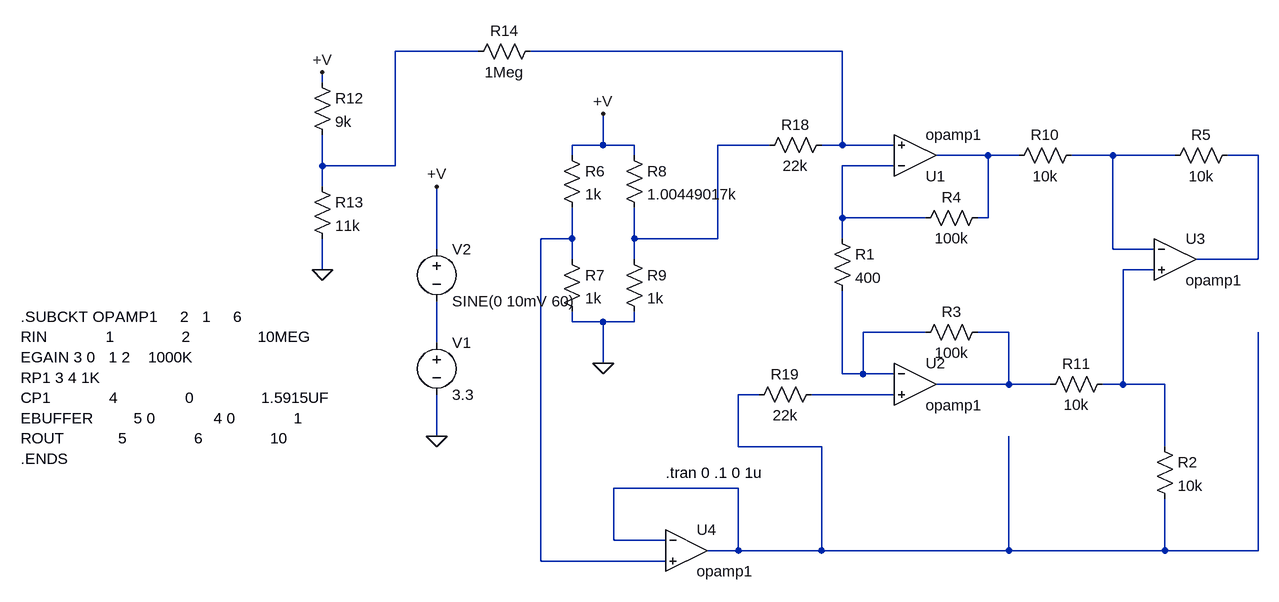
[diagram p0: schematic amp01.asc]
amp01.asc, the LTspice schematic file:
Version 4
SHEET 1 1124 732
WIRE -352 -272 -480 -272
WIRE 208 -272 -272 -272
WIRE -592 -224 -592 -240
WIRE -160 -128 -160 -176
WIRE -160 -128 -208 -128
WIRE -112 -128 -160 -128
WIRE 96 -128 16 -128
WIRE 208 -128 208 -272
WIRE 208 -128 176 -128
WIRE 288 -128 208 -128
WIRE -208 -112 -208 -128
WIRE -112 -112 -112 -128
WIRE 432 -112 352 -112
WIRE 480 -112 432 -112
WIRE 624 -112 560 -112
WIRE 720 -112 624 -112
WIRE 848 -112 800 -112
WIRE -592 -96 -592 -144
WIRE -480 -96 -480 -272
WIRE -480 -96 -592 -96
WIRE 288 -96 208 -96
WIRE -592 -64 -592 -96
WIRE 208 -16 208 -96
WIRE 336 -16 208 -16
WIRE 432 -16 432 -112
WIRE 432 -16 416 -16
WIRE -208 16 -208 -32
WIRE -208 16 -256 16
WIRE -112 16 -112 -32
WIRE 16 16 16 -128
WIRE 16 16 -112 16
WIRE 208 16 208 -16
WIRE -416 32 -416 -64
WIRE 624 32 624 -112
WIRE 688 32 624 32
WIRE -208 48 -208 16
WIRE -112 48 -112 16
WIRE 848 48 848 -112
WIRE 848 48 752 48
WIRE -592 64 -592 16
WIRE 688 64 640 64
WIRE -208 144 -208 128
WIRE -160 144 -208 144
WIRE -112 144 -112 128
WIRE -112 144 -160 144
WIRE 336 160 240 160
WIRE 464 160 416 160
WIRE -416 176 -416 112
WIRE -160 208 -160 144
WIRE 208 224 208 96
WIRE 240 224 240 160
WIRE 240 224 208 224
WIRE 288 224 240 224
WIRE 464 240 464 160
WIRE 464 240 352 240
WIRE 528 240 464 240
WIRE 640 240 640 64
WIRE 640 240 608 240
WIRE 704 240 640 240
WIRE 80 256 48 256
WIRE 288 256 160 256
WIRE -416 320 -416 256
WIRE 48 336 48 256
WIRE 176 336 48 336
WIRE 704 336 704 240
WIRE 48 400 -144 400
WIRE -144 480 -144 400
WIRE -64 480 -144 480
WIRE 48 496 48 400
WIRE 48 496 0 496
WIRE 176 496 176 336
WIRE 176 496 48 496
WIRE 464 496 464 320
WIRE 464 496 176 496
WIRE 704 496 704 416
WIRE 704 496 464 496
WIRE 848 496 848 160
WIRE 848 496 704 496
WIRE -256 512 -256 16
WIRE -64 512 -256 512
FLAG -416 -64 +V
FLAG -416 320 0
FLAG -160 208 0
FLAG -160 -176 +V
FLAG -592 64 0
FLAG -592 -240 +V
SYMBOL res 192 0 R0
SYMATTR InstName R1
SYMATTR Value 400
SYMBOL res 688 320 R0
SYMATTR InstName R2
SYMATTR Value 10k
SYMBOL res 432 144 R90
WINDOW 0 0 56 VBottom 2
WINDOW 3 32 56 VTop 2
SYMATTR InstName R3
SYMATTR Value 100k
SYMBOL res 432 -32 R90
WINDOW 0 0 56 VBottom 2
WINDOW 3 32 56 VTop 2
SYMATTR InstName R4
SYMATTR Value 100k
SYMBOL res 816 -128 R90
WINDOW 0 0 56 VBottom 2
WINDOW 3 32 56 VTop 2
SYMATTR InstName R5
SYMATTR Value 10k
SYMBOL voltage -416 160 R0
WINDOW 123 0 0 Left 2
WINDOW 39 0 0 Left 2
SYMATTR InstName V1
SYMATTR Value 3.3
SYMBOL res -224 -128 R0
SYMATTR InstName R6
SYMATTR Value 1k
SYMBOL res -224 32 R0
SYMATTR InstName R7
SYMATTR Value 1k
SYMBOL res -128 -128 R0
SYMATTR InstName R8
SYMATTR Value 1.00449017k
SYMBOL res -128 32 R0
SYMATTR InstName R9
SYMATTR Value 1k
SYMBOL res 576 -128 R90
WINDOW 0 0 56 VBottom 2
WINDOW 3 32 56 VTop 2
SYMATTR InstName R10
SYMATTR Value 10k
SYMBOL res 624 224 R90
WINDOW 0 0 56 VBottom 2
WINDOW 3 32 56 VTop 2
SYMATTR InstName R11
SYMATTR Value 10k
SYMBOL Opamps\\opamp 320 -48 M180
SYMATTR InstName U1
SYMATTR SpiceLine ""
SYMATTR Value opamp1
SYMATTR SpiceLine2 ""
SYMBOL Opamps\\opamp 320 176 R0
SYMATTR InstName U2
SYMATTR SpiceLine ""
SYMATTR Value opamp1
SYMATTR SpiceLine2 ""
SYMBOL Opamps\\opamp 720 -16 R0
SYMATTR InstName U3
SYMATTR SpiceLine ""
SYMATTR Value opamp1
SYMATTR SpiceLine2 ""
SYMBOL Opamps\\opamp -32 432 R0
SYMATTR InstName U4
SYMATTR SpiceLine ""
SYMATTR Value opamp1
SYMATTR SpiceLine2 ""
SYMBOL voltage -416 16 R0
WINDOW 123 0 0 Left 2
WINDOW 39 0 0 Left 2
SYMATTR InstName V2
SYMATTR Value SINE(0 10mV 60)
SYMBOL res -608 -240 R0
SYMATTR InstName R12
SYMATTR Value 9k
SYMBOL res -608 -80 R0
SYMATTR InstName R13
SYMATTR Value 11k
SYMBOL res -256 -288 R90
WINDOW 0 0 56 VBottom 2
WINDOW 3 32 56 VTop 2
SYMATTR InstName R14
SYMATTR Value 1Meg
SYMBOL res 192 -144 R90
WINDOW 0 0 56 VBottom 2
WINDOW 3 32 56 VTop 2
SYMATTR InstName R18
SYMATTR Value 22k
SYMBOL res 176 240 R90
WINDOW 0 0 56 VBottom 2
WINDOW 3 32 56 VTop 2
SYMATTR InstName R19
SYMATTR Value 22k
TEXT -64 376 Left 2 !.tran 0 .1 0 1u
TEXT -1056 136 Left 2 !.SUBCKT OPAMP1     2   1     6\nRIN             1               2               10MEG\nEGAIN 3 0   1 2    1000K\nRP1 3 4 1K\nCP1             4               0               1.5915UF\nEBUFFER         5 0             4 0             1\nROUT            5               6               10\n.ENDS

The netlist it stands for:
* amp01.asc
R1 N007 N010 400
R2 N009 N013 10k
R3 N011 N010 100k
R4 N004 N007 100k
R5 N006 N005 10k
V1 N012 0 3.3
R6 +V N008 1k
R7 N008 0 1k
R8 +V N003 1.00449017k
R9 N003 0 1k
R10 N005 N004 10k
R11 N009 N011 10k
XU1 N007 N002 N004 opamp1  ; pins invin noninvin out
XU2 N010 N014 N011 opamp1  ; pins invin noninvin out
XU3 N005 N009 N006 opamp1  ; pins invin noninvin out
XU4 N013 N008 N013 opamp1  ; pins invin noninvin out
V2 +V N012 SINE(0 10mV 60)
R12 +V N001 9k
R13 N001 0 11k
R14 N002 N001 1Meg
R18 N002 N003 22k
R19 N014 N013 22k
.tran 0 .1 0 1u
.SUBCKT OPAMP1     2   1     6
RIN             1               2               10MEG
EGAIN 3 0   1 2    1000K
RP1 3 4 1K
CP1             4               0               1.5915UF
EBUFFER         5 0             4 0             1
ROUT            5               6               10
.ENDS
.backanno
.end